# Altium schematic sheet LED_Controller_Wireless.SchDoc
size A4; Organization: ENEL429 Group N; Address1: ECE Department; Address2: University of Canterbury; Address3: Christchurch 8041; Address4: New Zealand; Revision: 1
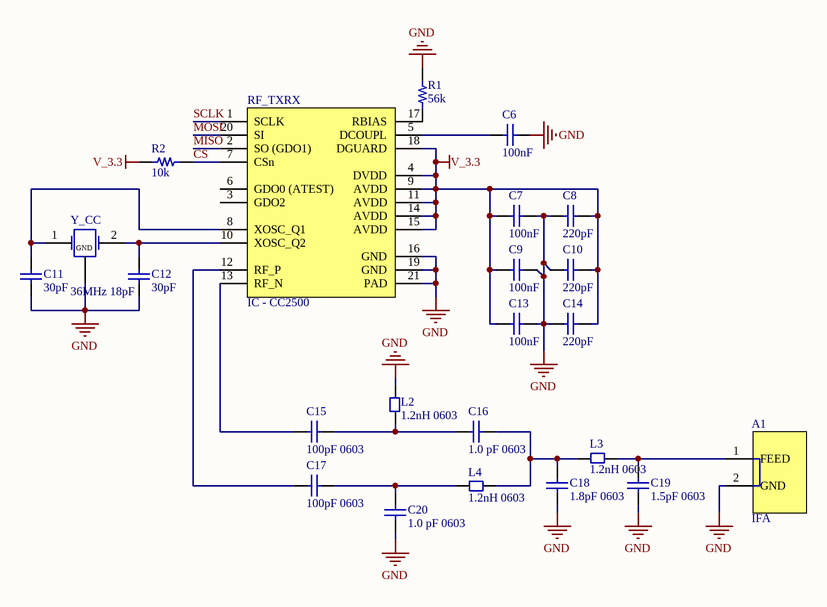
[diagram p0: LED_Controller_Wireless.SchDoc]

## Parts
A1  IFA  [Meandered_Inverted_F_Antenna]
C6  100nF  [0603]
C7  100nF  [0603]
C8  220pF  [0603]
C9  100nF  [0603]
C10  220pF  [0603]
C11  30pF  [0603]
C12  30pF  [0603]
C13  100nF  [0603]
C14  220pF  [0603]
C15  100pF 0603  [0603]
C16  1.0 pF 0603  [0603]
C17  100pF 0603  [0603]
C18  1.8pF 0603  [0603]
C19  1.5pF 0603  [0603]
C20  1.0 pF 0603  [0603]
L2  1.2nH 0603  [0603]
L3  1.2nH 0603  [0603]
L4  1.2nH 0603  [0603]
R1  56k  [0603]
R2  10k  [0603]
RF_TXRX  IC - CC2500  [TI - RTK / QFN50P400X400X90-20N]
Y_CC  36MHz 18pF  [7M-36.000MAAJ-T]

## Nets
GND: A1.2(GND) C6.2 C7.1 C8.1 C9.1 C10.1 C11.1 C12.1 C13.1 C14.1 C18.1 C19.1 C20.1 L2.2 R1.2 RF_TXRX.16(GND) RF_TXRX.19(GND) RF_TXRX.21(PAD) Y_CC.3(GND)
V_3.3: C7.2 C8.2 C9.2 C10.2 C13.2 C14.2 R2.2 RF_TXRX.4(DVDD) RF_TXRX.9(AVDD) RF_TXRX.11(AVDD) RF_TXRX.14(AVDD) RF_TXRX.15(AVDD) RF_TXRX.18(DGUARD)
CS: R2.1 RF_TXRX.7(CSn)
MISO: RF_TXRX.2(SO_(GDO1))
MOSI: RF_TXRX.20(SI)
SCLK: RF_TXRX.1(SCLK)
NetA1_1: A1.1(FEED) C19.2 L3.2
NetC6_1: C6.1 RF_TXRX.5(DCOUPL)
NetC11_2: C11.2 RF_TXRX.8(XOSC_Q1) Y_CC.1
NetC12_2: C12.2 RF_TXRX.10(XOSC_Q2) Y_CC.2
NetC15_1: C15.1 RF_TXRX.13(RF_N)
NetC15_2: C15.2 C16.1 L2.1
NetC16_2: C16.2 C18.2 L3.1 L4.1
NetC17_1: C17.1 RF_TXRX.12(RF_P)
NetC17_2: C17.2 C20.2 L4.2
NetR1_1: R1.1 RF_TXRX.17(RBIAS)

Not connected (* = marked no-connect by the designer): RF_TXRX 3(GDO2) 6(GDO0_(ATEST))

## Notes on the sheet
- Title
- Drawn by:
- Date:
- Time:
- Revision:
- Sheet
- of
- File:

## Library data of the parts
A1 = Meandered_Inverted_F_Antenna
C6 C7 C9 C13 = CP - 100nF 0603: CAP CER .10UF 50V X5R 0603; Manufacturer: AVX Corporation; Manufacturer Part Number: 06035D104KAT2A; Capacitance: 0.1µF; Tolerance: ±10%; Supplier 1: Digi-Key; Supplier Part Number 1: 478-6206-1-ND; RoHS: RoHS Compliant; Category: Capacitors; Stock 1: 0; Pricing 1: 10=0.33, 100=0.195, 500=0.1125, 1000=0.078 (USD); Voltage - Rated: 50V; Temperature Coefficient: X5R; Mounting Type: Surface Mount, MLCC; Operating Temperature: -55°C ~ 85°C; Applications: General Purpose; Ratings: -; Package / Case: 0603 (1608 Metric); Size / Dimension: 0.063" L x 0.032" W (1.60mm x 0.81mm); Height: -; Thickness: 0.035" (0.90mm); Lead Spacing: -; Features: -; Packaging: Cut Tape (CT); Lead Style: -; ComponentLink1URL: http://www.avx.com/docs/Catalogs/cx5r.pdf; ComponentLink1Description: http://www.avx.com/docs/Catalogs/cx5r.pdf
C8 C10 C14 = CP - 220pF 0603: CAP CER 220PF 50V NP0 0603; Manufacturer: Johanson Dielectrics Inc; Manufacturer Part Number: 500R14N221JV4T; Tolerance: ±5%; Temperature Coefficient: C0G, NP0; Supplier 1: Digi-Key; RoHS: RoHS Compliant; Category: Capacitors; Stock 1: 21369; Pricing 1: 10=0.047, 100=0.028, 500=0.01612, 1000=0.01118 (USD); Capacitance: 220pF; Voltage - Rated: 50V; Mounting Type: Surface Mount, MLCC; Operating Temperature: -55°C ~ 125°C; Applications: General Purpose; Ratings: -; Package / Case: 0603 (1608 Metric); Size / Dimension: 0.063" L x 0.032" W (1.60mm x 0.81mm); Height: -; Thickness: 0.035" (0.89mm); Lead Spacing: -; Features: -; Packaging: Cut Tape (CT); Lead Style: -; ComponentLink1URL: http://www.johansondielectrics.com/images/stories/surface-mount/smt-mlc/JDI_Surface-Mount_2008-11.pdf; ComponentLink1Description: http://www.johansondielectrics.com/images/stories/surface-mount/smt-mlc/JDI_Surface-Mount_2008-11.pdf; Supplier Part Number 1: 709-1148-1-ND
C11 C12 = CP - 30pF 0603: CAP CER 30PF 50V C0G 0603; Manufacturer: TDK Corporation; Manufacturer Part Number: C1608C0G1H300J; Tolerance: ±5%; Temperature Coefficient: C0G, NP0; Supplier 1: Digi-Key; RoHS: RoHS Compliant; Category: Capacitors; Stock 1: 25238; Pricing 1: 1=0.13, 10=0.083, 100=0.0297, 250=0.02144, 500=0.01584, 1000=0.01073 (USD); Capacitance: 30pF; Voltage - Rated: 50V; Mounting Type: Surface Mount, MLCC; Operating Temperature: -55°C ~ 125°C; Applications: General Purpose; Ratings: -; Package / Case: 0603 (1608 Metric); Size / Dimension: 0.063" L x 0.031" W (1.60mm x 0.80mm); Height: -; Thickness: 0.037" (0.95mm); Lead Spacing: -; Features: -; Packaging: Cut Tape (CT); Lead Style: -; ComponentLink1URL: http://www.tdk.com/pdf/general_B11.pdf; ComponentLink1Description: http://www.tdk.com/pdf/general_B11.pdf; Supplier Part Number 1: 445-5054-1-ND
C15 C17 = CP - 100pF 0603: CAP CERM 100PF 5% 50V NP0 0603; Manufacturer: AVX Corporation; Manufacturer Part Number: 06035A101JAT2A; Temperature Coefficient: C0G, NP0; Supplier 1: Digi-Key; RoHS: RoHS Compliant; Category: Capacitors; Stock 1: 1724543; Pricing 1: 10=0.028, 100=0.0163, 500=0.00938, 1000=0.0065 (USD); Capacitance: 100pF; Voltage - Rated: 50V; Tolerance: ±5%; Mounting Type: Surface Mount, MLCC; Operating Temperature: -55°C ~ 125°C; Applications: General Purpose; Ratings: -; Package / Case: 0603 (1608 Metric); Size / Dimension: 0.063" L x 0.032" W (1.60mm x 0.81mm); Height: -; Thickness: 0.035" (0.90mm); Lead Spacing: -; Features: -; Packaging: Cut Tape (CT); Lead Style: -; ComponentLink1URL: http://www.avx.com/docs/Catalogs/ccog.pdf; ComponentLink1Description: http://www.avx.com/docs/Catalogs/ccog.pdf; Supplier Part Number 1: 478-1175-1-ND
C16 C20 = CP - 1.0pF 0603: CAP CER 1.0PF 50V C0G 0603; Manufacturer: TDK Corporation; Manufacturer Part Number: C1608C0G1H010C; Tolerance: ±0.25pF; Temperature Coefficient: C0G, NP0; Supplier 1: Digi-Key; RoHS: RoHS Compliant; Category: Capacitors; Stock 1: 89185; Pricing 1: 1=0.09, 10=0.058, 100=0.0207, 250=0.01496, 500=0.01104, 1000=0.00748 (USD); Capacitance: 1.0pF; Voltage - Rated: 50V; Mounting Type: Surface Mount, MLCC; Operating Temperature: -55°C ~ 125°C; Applications: General Purpose; Ratings: -; Package / Case: 0603 (1608 Metric); Size / Dimension: 0.063" L x 0.031" W (1.60mm x 0.80mm); Height: -; Thickness: 0.037" (0.95mm); Lead Spacing: -; Features: -; Packaging: Cut Tape (CT); Lead Style: -; ComponentLink1URL: http://www.tdk.com/pdf/general_B11.pdf; ComponentLink1Description: http://www.tdk.com/pdf/general_B11.pdf; Supplier Part Number 1: 445-5009-1-ND
C18 = CP - 1.8pF 0603: CAP CER 1.8PF 50V C0G 0603; Manufacturer: TDK Corporation; Manufacturer Part Number: C1608C0G1H1R8C; Tolerance: ±0.25pF; Temperature Coefficient: C0G, NP0; Supplier 1: Digi-Key; RoHS: RoHS Compliant; Category: Capacitors; Stock 1: 2092; Pricing 1: 1=0.12, 10=0.075, 100=0.027, 250=0.01952, 500=0.0144, 1000=0.00975 (USD); Capacitance: 1.8pF; Voltage - Rated: 50V; Mounting Type: Surface Mount, MLCC; Operating Temperature: -55°C ~ 125°C; Applications: General Purpose; Ratings: -; Package / Case: 0603 (1608 Metric); Size / Dimension: 0.063" L x 0.031" W (1.60mm x 0.80mm); Height: -; Thickness: 0.037" (0.95mm); Lead Spacing: -; Features: -; Packaging: Cut Tape (CT); Lead Style: -; ComponentLink1URL: http://www.tdk.com/pdf/general_B11.pdf; ComponentLink1Description: http://www.tdk.com/pdf/general_B11.pdf; Supplier Part Number 1: 445-5015-1-ND
C19 = CP - 1.5pF 0603: CAP CER 1.5PF 50V C0G 0603; Manufacturer: TDK Corporation; Manufacturer Part Number: C1608C0G1H1R5C; Tolerance: ±0.25pF; Temperature Coefficient: C0G, NP0; Supplier 1: Digi-Key; RoHS: RoHS Compliant; Category: Capacitors; Stock 1: 31690; Pricing 1: 1=0.09, 10=0.058, 100=0.0207, 250=0.01496, 500=0.01104, 1000=0.00748 (USD); Capacitance: 1.5pF; Voltage - Rated: 50V; Mounting Type: Surface Mount, MLCC; Operating Temperature: -55°C ~ 125°C; Applications: General Purpose; Ratings: -; Package / Case: 0603 (1608 Metric); Size / Dimension: 0.063" L x 0.031" W (1.60mm x 0.80mm); Height: -; Thickness: 0.037" (0.95mm); Lead Spacing: -; Features: -; Packaging: Cut Tape (CT); Lead Style: -; ComponentLink1URL: http://www.tdk.com/pdf/general_B11.pdf; ComponentLink1Description: http://www.tdk.com/pdf/general_B11.pdf; Supplier Part Number 1: 445-5013-1-ND
L2-L4 = L - 1.2nH 0603: INDUCTOR HI FREQ 1.2+/-0.3NH; Manufacturer: Taiyo Yuden; Manufacturer Part Number: HK16081N2S-T; Current: 300mA; Type: Ceramic; Tolerance: ±0.3nH; DC Resistance (DCR): 50 mOhm Max; Q @ Freq: 8 @ 100MHz; Self Resonant Freq: 10GHz; Frequency - Test: 100MHz; Supplier 1: Digi-Key; RoHS: RoHS Compliant; Category: Inductors, Coils, Chokes; Stock 1: 35758; Pricing 1: 1=0.07, 10=0.064, 50=0.06, 100=0.056, 500=0.044, 1000=0.036 (USD); Inductance: 1.2nH; Current - Saturation: -; Current - Temperature Rise: -; Shielding: -; Package / Case: 0603 (1608 Metric); Mounting Type: Surface Mount; Packaging: Cut Tape (CT); Operating Temperature: -40°C ~ 85°C; Material - Core: -; Applications: General Purpose; ComponentLink1URL: http://www.yuden.co.jp/ut/product/pdf/mlci04_e.pdf; ComponentLink1Description: http://www.yuden.co.jp/ut/product/pdf/mlci04_e.pdf; Supplier Part Number 1: 587-1534-1-ND
R1 = RS - 56k 0603: RES 56K OHM 1/10W 5% 0603 SMD; Manufacturer: Yageo; Manufacturer Part Number: RC0603JR-0756KL; Power (Watts): 0.1W, 1/10W; Temperature Coefficient: ±100ppm/°C; Supplier 1: Digi-Key; Supplier Part Number 1: 311-56KGRCT-ND; RoHS: RoHS Compliant; Category: Resistors; Stock 1: 236462; Pricing 1: 10=0.01, 50=0.008, 100=0.006, 250=0.00448, 500=0.00332, 1000=0.00221 (USD); Resistance (Ohms): 56K; Composition: Thick Film; Features: -; Tolerance: ±5%; Size / Dimension: 0.063" L x 0.031" W (1.60mm x 0.80mm); Height: 0.022" (0.55mm); Number of Terminations: 2; Packaging: Cut Tape (CT); Package / Case: 0603 (1608 Metric); ComponentLink1URL: http://www.yageo.com/documents/recent/PYu-RC0603_51_RoHS_L_4.pdf; ComponentLink1Description: http://www.yageo.com/documents/recent/PYu-RC0603_51_RoHS_L_4.pdf
R2 = RS - 10k 0603: RES 10.0K OHM 1/10W 1% 0603 SMD; Manufacturer: Yageo; Manufacturer Part Number: RC0603FR-0710KL; Power (Watts): 0.1W, 1/10W; Temperature Coefficient: ±100ppm/°C; Supplier 1: Digi-Key; Supplier Part Number 1: 311-10.0KHRCT-ND; RoHS: RoHS Compliant; Category: Resistors; Stock 1: 9813840; Pricing 1: 10=0.014, 50=0.0104, 100=0.0079, 250=0.00584, 500=0.00432, 1000=0.00288 (USD); Resistance (Ohms): 10K; Composition: Thick Film; Features: -; Tolerance: ±1%; Size / Dimension: 0.063" L x 0.031" W (1.60mm x 0.80mm); Height: 0.022" (0.55mm); Number of Terminations: 2; Packaging: Cut Tape (CT); Package / Case: 0603 (1608 Metric); ComponentLink1URL: http://www.yageo.com/documents/recent/PYu-RC0603_51_RoHS_L_4.pdf; ComponentLink1Description: http://www.yageo.com/documents/recent/PYu-RC0603_51_RoHS_L_4.pdf
RF_TXRX = IC - CC2500: IC RF TXRX SNGL-CHIP LP 20-QFN; Manufacturer: Texas Instruments; Manufacturer Part Number: CC2500RTKR; Frequency: 2.4GHz; Data Rate - Maximum: 500kBaud; Modulation or Protocol: 2-FSK, ASK, GFSK, MSK, OOK; Power - Output: -30dBm ~ 10dBm; Sensitivity: -104dBm; Voltage - Supply: 1.8 V ~ 3.6 V; Current - Receiving: 17mA; Current - Transmitting: 21.5mA @ 1 dBm; Data Interface: PCB, Surface Mount; Supplier 1: Digi-Key; RoHS: RoHS Compliant; Category: RF/IF and RFID; Stock 1: 20005; Pricing 1: 1=4.2, 25=3.43, 100=3.08, 250=2.8, 500=2.45, 1000=2.1 (USD); Applications: ISM, SRD; Memory Size: -; Antenna Connector: PCB, Surface Mount; Operating Temperature: -40°C ~ 85°C; Package / Case: 20-VQFN Exposed Pad, 20-HVQFN, 20-SQFN, 20-DHVQFN; Packaging: Cut Tape (CT); ComponentLink1URL: http://focus.ti.com/lit/ds/symlink/cc2500.pdf; ComponentLink1Description: http://focus.ti.com/lit/ds/symlink/cc2500.pdf; Supplier Part Number 1: 296-19586-1-ND
Y_CC = X - 36MHz 18pF: CRYSTAL 36.000 MHZ 18PF SMD; Manufacturer: TXC CORPORATION; Frequency Stability: ±30ppm; Operating Mode: Fundamental; Supplier 1: Digi-Key; Manufacturer Part Number: 7M-36.000MAAJ-T; RoHS: RoHS Compliant; Category: Crystals and Oscillators; Stock 1: 5817; Pricing 1: 1=1.31, 10=1.138, 50=0.9976, 100=0.7875, 500=0.665, 1000=0.525 (USD); Type: MHz Crystal; Frequency: 36MHz; Frequency Tolerance: ±30ppm; Load Capacitance: 18pF; Operating Temperature: -20°C ~ 70°C; Mounting Type: Surface Mount; Package / Case: 4-SMD, No Lead (DFN, LCC); Size / Dimension: 0.126" L x 0.098" W (3.20mm x 2.50mm); Height: 0.031" (0.80mm); Packaging: Cut Tape (CT); ComponentLink1URL: http://www.txccrystal.com/images/pdf/7m.pdf; ComponentLink1Description: http://www.txccrystal.com/images/pdf/7m.pdf; Supplier Part Number 1: 887-1137-1-ND